# Altium project allaki_mezzanine.PrjPCB (part 1 of 2)
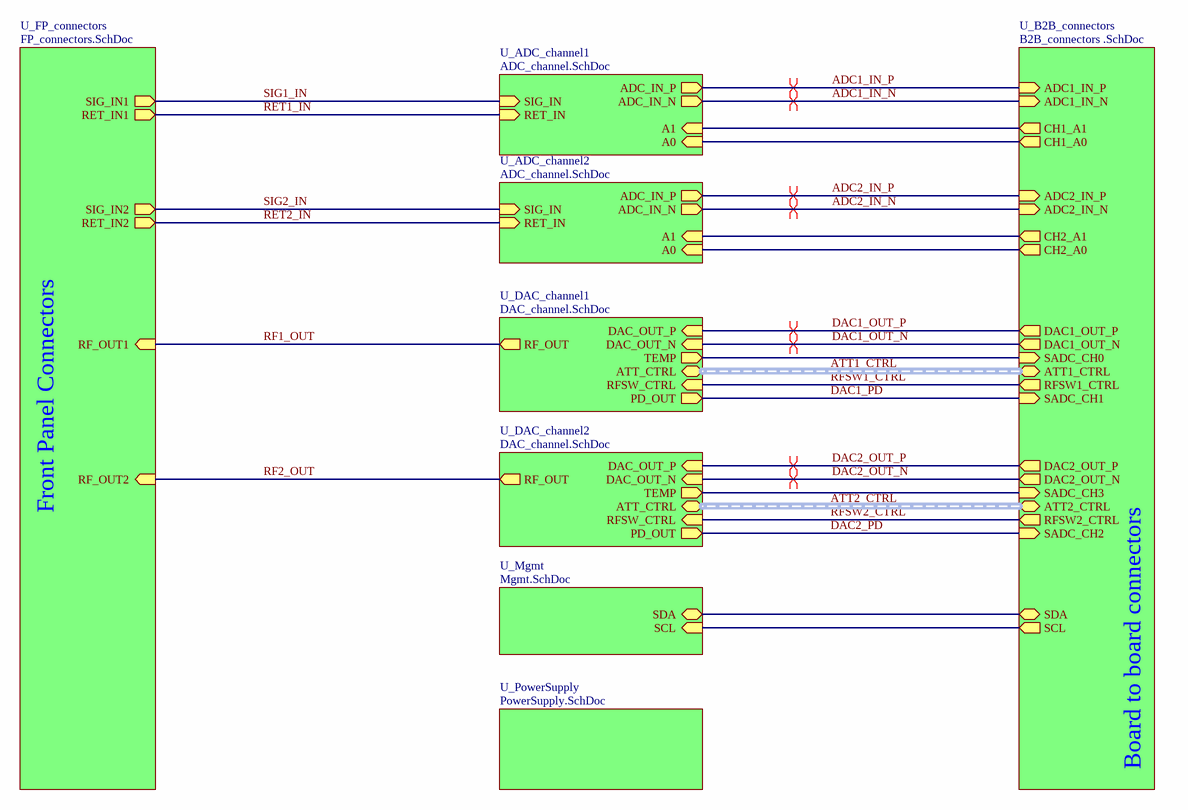
[diagram p0: allaki_mezz_top.SchDoc]
7 sheets, 312 parts. Net scope: hierarchical (ports join the sheet entries above them; power ports are global).
Board file: allaki_mezzanine.PcbDoc
Sheets:
  allaki_mezz_top.SchDoc
    U_ADC_channel1 = ADC_channel.SchDoc
    U_DAC_channel1 = DAC_channel.SchDoc
    U_ADC_channel2 = ADC_channel.SchDoc
    U_DAC_channel2 = DAC_channel.SchDoc
    U_FP_connectors = FP_connectors.SchDoc
    U_B2B_connectors = B2B_connectors .SchDoc
    U_PowerSupply = PowerSupply.SchDoc
    U_Mgmt = Mgmt.SchDoc

## Sheet allaki_mezz_top.SchDoc: =ProjectName
size 420 x 297 mm; Author: SBH; CompanyName: WUT; DrawnBy: SBH; Organization: ISE-WUT; Address1: Warsaw Univeristy of Technology; Address2: Nowowiejska 15/19; Revision: -; SheetNumber: 1; EDA_Number: ARTIQ; Projet: ADC/DAC MEZZANINE; ModifiedBy: -; CreateDate: XX/XX/XXXX; CheckedDate: -; Title2: allaki_mezz_top.SchDoc; DivGrp: ISE; Designer: SBH; ModifiedDate: -; ProjectName: ADC/DAC MEZZANINE

### Sub-sheets
U_ADC_channel1 = ADC_channel.SchDoc: ADC_IN_N (out), ADC_IN_P (out), SIG_IN (in), RET_IN (in), A1 (in), A0 (in)
U_ADC_channel2 = ADC_channel.SchDoc: ADC_IN_P (out), ADC_IN_N (out), SIG_IN (in), RET_IN (in), A1 (in), A0 (in)
U_B2B_connectors = B2B_connectors .SchDoc: ADC1_IN_N (in), ADC1_IN_P (in), DAC1_OUT_N (out), DAC1_OUT_P (out), DAC2_OUT_N (out), DAC2_OUT_P (out), ADC2_IN_N (in), ADC2_IN_P (in), ATT1_CTRL (harness ATT_CTRL), ATT2_CTRL (harness ATT_CTRL), RFSW1_CTRL (out), RFSW2_CTRL (out), SDA (bidir), SCL (out), SADC_CH2 (in), SADC_CH1 (in), CH1_A0 (out), CH2_A1 (out), CH1_A1 (out), CH2_A0 (out), SADC_CH0 (in), SADC_CH3 (in)
U_DAC_channel1 = DAC_channel.SchDoc: DAC_OUT_P (in), DAC_OUT_N (in), RF_OUT (out), ATT_CTRL (harness ATT_CTRL), RFSW_CTRL (in), PD_OUT (out), TEMP (out)
U_DAC_channel2 = DAC_channel.SchDoc: DAC_OUT_P (in), DAC_OUT_N (in), RF_OUT (out), RFSW_CTRL (in), ATT_CTRL (harness ATT_CTRL), PD_OUT (out), TEMP (out)
U_FP_connectors = FP_connectors.SchDoc: RF_OUT1 (in), RF_OUT2 (in), SIG_IN1 (out), SIG_IN2 (out), RET_IN1 (out), RET_IN2 (out)
U_Mgmt = Mgmt.SchDoc: SDA (bidir), SCL (in)
U_PowerSupply = PowerSupply.SchDoc: no entries

### Nets
ADC1_IN_N: sheet U_ADC_channel1/ADC_IN_N, sheet U_B2B_connectors/ADC1_IN_N
ADC1_IN_P: sheet U_ADC_channel1/ADC_IN_P, sheet U_B2B_connectors/ADC1_IN_P
ADC2_IN_N: sheet U_ADC_channel2/ADC_IN_N, sheet U_B2B_connectors/ADC2_IN_N
ADC2_IN_P: sheet U_ADC_channel2/ADC_IN_P, sheet U_B2B_connectors/ADC2_IN_P
ADC_CH0: sheet U_DAC_channel1/TEMP, sheet U_B2B_connectors/SADC_CH0
ADC_CH1: sheet U_DAC_channel2/TEMP, sheet U_B2B_connectors/SADC_CH3
DAC1_OUT_N: sheet U_DAC_channel1/DAC_OUT_N, sheet U_B2B_connectors/DAC1_OUT_N
DAC1_OUT_P: sheet U_DAC_channel1/DAC_OUT_P, sheet U_B2B_connectors/DAC1_OUT_P
DAC1_PD: sheet U_DAC_channel1/PD_OUT, sheet U_B2B_connectors/SADC_CH1  [project net ADC_CH3]
DAC2_OUT_N: sheet U_DAC_channel2/DAC_OUT_N, sheet U_B2B_connectors/DAC2_OUT_N
DAC2_OUT_P: sheet U_DAC_channel2/DAC_OUT_P, sheet U_B2B_connectors/DAC2_OUT_P
DAC2_PD: sheet U_DAC_channel2/PD_OUT, sheet U_B2B_connectors/SADC_CH2  [project net ADC_CH2]
MEZZ_IO4: sheet U_ADC_channel1/A1, sheet U_B2B_connectors/CH1_A1
MEZZ_IO5: sheet U_ADC_channel1/A0, sheet U_B2B_connectors/CH1_A0
MEZZ_IO8: sheet U_ADC_channel2/A1, sheet U_B2B_connectors/CH2_A1
MEZZ_IO10: sheet U_ADC_channel2/A0, sheet U_B2B_connectors/CH2_A0
RET1_IN: sheet U_ADC_channel1/RET_IN, sheet U_FP_connectors/RET_IN1
RET2_IN: sheet U_ADC_channel2/RET_IN, sheet U_FP_connectors/RET_IN2
RF1_OUT: sheet U_DAC_channel1/RF_OUT, sheet U_FP_connectors/RF_OUT1
RF2_OUT: sheet U_DAC_channel2/RF_OUT, sheet U_FP_connectors/RF_OUT2
RFSW1_CTRL: sheet U_DAC_channel1/RFSW_CTRL, sheet U_B2B_connectors/RFSW1_CTRL  [project net MEZZ_IO7]
RFSW2_CTRL: sheet U_DAC_channel2/RFSW_CTRL, sheet U_B2B_connectors/RFSW2_CTRL  [project net MEZZ_IO2]
SCL: sheet U_B2B_connectors/SCL, sheet U_Mgmt/SCL
SDA: sheet U_B2B_connectors/SDA, sheet U_Mgmt/SDA
SIG1_IN: sheet U_ADC_channel1/SIG_IN, sheet U_FP_connectors/SIG_IN1
SIG2_IN: sheet U_ADC_channel2/SIG_IN, sheet U_FP_connectors/SIG_IN2

### Buses and harness runs
harness ATT1_CTRL = sheet U_B2B_connectors/ATT1_CTRL = sheet U_DAC_channel1/ATT_CTRL
harness ATT2_CTRL = sheet U_B2B_connectors/ATT2_CTRL = sheet U_DAC_channel2/ATT_CTRL

### Layout directives
differential pair: ADC1_IN_N, ADC1_IN_P, ADC2_IN_N, ADC2_IN_P, DAC1_OUT_N, DAC1_OUT_P, DAC2_OUT_N, DAC2_OUT_P

### Notes on the sheet
- Front Panel Connectors
- Board to board connectors
- Project/Equipment
- Document
- Designer
- Drawn by
- Check.by
- File
- Last Mod.
- Print Date
- Sheet
- Size
- A3
- of
- Rev

## Sheet ADC_channel.SchDoc: =ProjectName
size 420 x 297 mm; Author: SBH; CompanyName: WUT; DrawnBy: SBH; Organization: ISE-WUT; Address1: Warsaw Univeristy of Technology; Address2: Nowowiejska 15/19; Revision: -; SheetNumber: -; SheetTotal: -; EDA_Number: ARTIQ; Projet: ADC/DAC MEZZANINE; ModifiedBy: -; CreateDate: XX/XX/XXXX; CheckedDate: -; Title2: ADC_channel.SchDoc; DivGrp: ISE; Designer: SBH; ModifiedDate: -; ProjectName: ADC/DAC MEZZANINE
Used 2 times, as channels U_ADC_channel1, U_ADC_channel2. Parts and nets are listed once, with the designators drawn on the sheet.
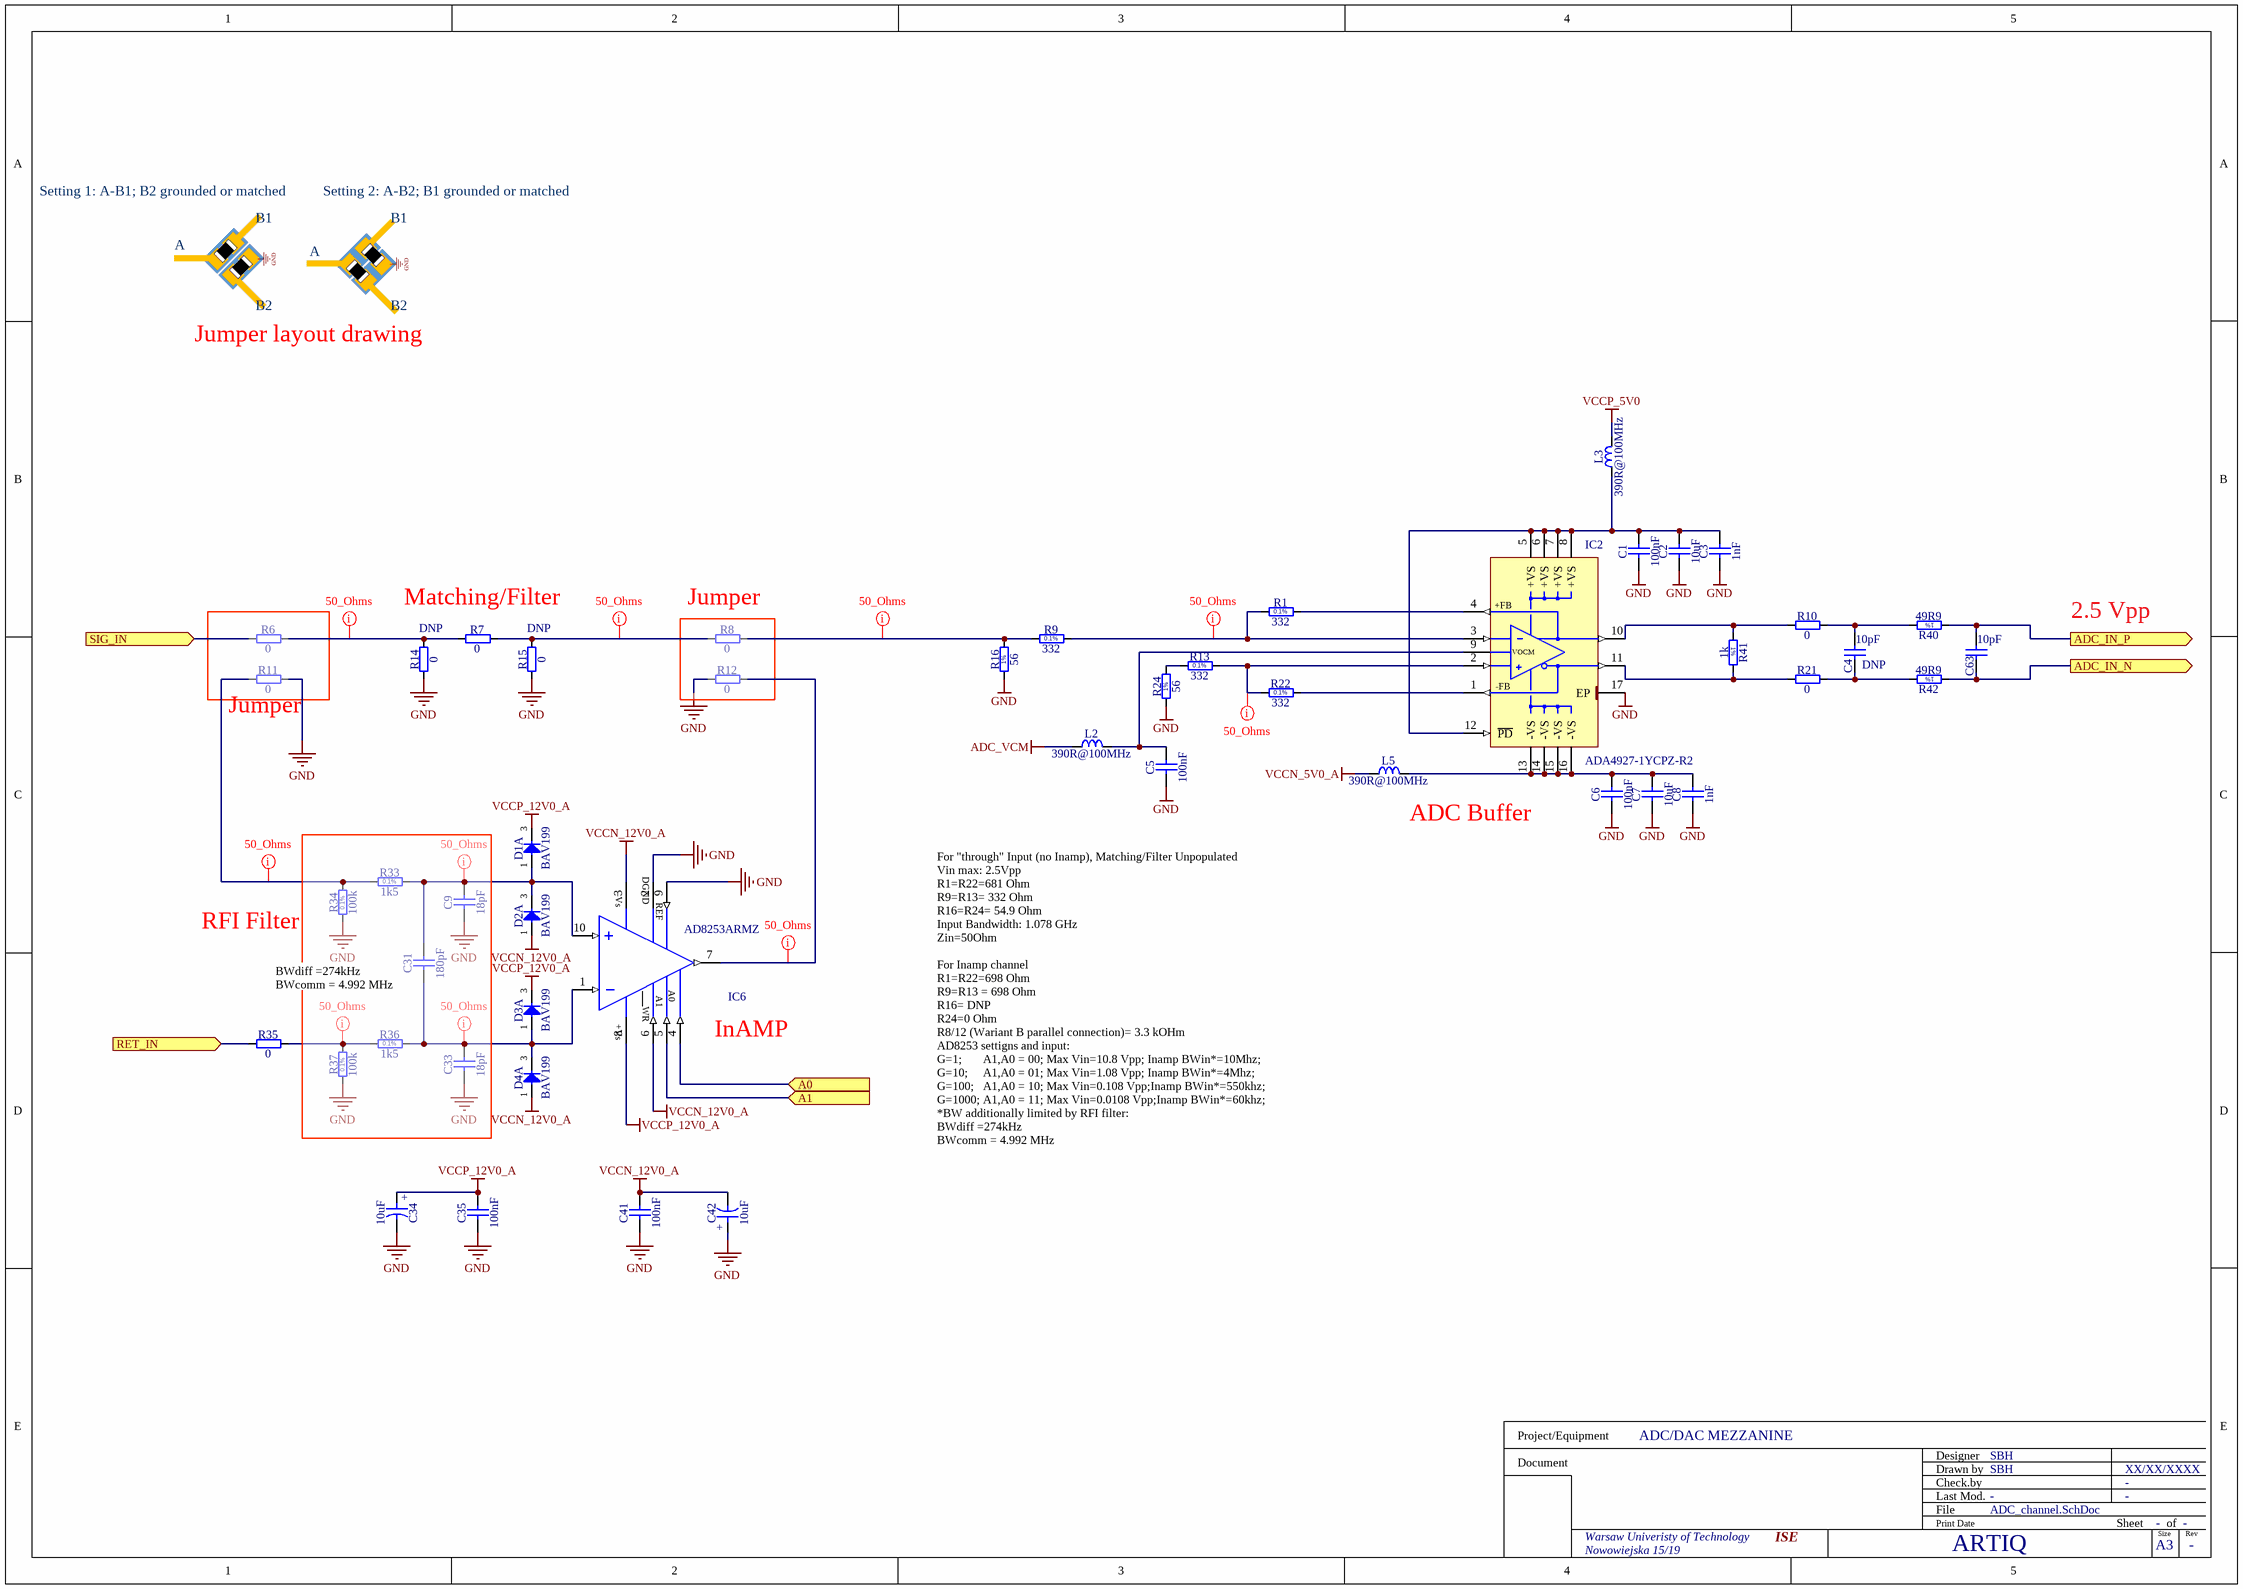
[diagram p1: ADC_channel.SchDoc]

### Parts
C1  100nF  [CAPC1005X55N]
C2  10uF  [CAPC1608X87N]
C3  1nF  [CAPC1005X55N]
C4  10pF  Mounted: DNP  [CAPC1608X87N]
C5  100nF  [CAPC1005X55N]
C6  100nF  [CAPC1005X55N]
C7  10uF  [CAPC1608X87N]
C8  1nF  [CAPC1005X55N]
C9  18pF  [CAPC1005X55N]
C31  180pF  [CAPC3216X140N]
C33  18pF  [CAPC1005X55N]
C34  10uF  [CAPMP3216X180N]
C35  100nF  [CAPC1005X55N]
C41  100nF  [CAPC1005X55N]
C42  10uF  [CAPMP3216X180N]
C63  10pF  [CAPC1608X87N]
D1  BAV199  [SOT95P240X110-3N]  (part A of 2)
D2  BAV199  [SOT95P240X110-3N]  (part A of 2)
D3  BAV199  [SOT95P240X110-3N]  (part A of 2)
D4  BAV199  [SOT95P240X110-3N]  (part A of 2)
IC2  ADA4927-1YCPZ-R2  [QFN50P300X300X100-17N-S145]
IC6  AD8253ARMZ  [SOP50P490X110-10N]
L2  390R@100MHz  [INDC1608X95N]
L3  390R@100MHz  [INDC1608X95N]
L5  390R@100MHz  [INDC1608X95N]
R1  332  [RESC1608X55N]
R6  0  [RESC1005X40N]
R7  0  [RESC1005X40N]
R8  0  [RESC1005X40N]
R9  332  [RESC1608X55N]
R10  0  [RESC1005X40N]
R11  0  [RESC1005X40N]
R12  0  [RESC1005X40N]
R13  332  [RESC1608X55N]
R14  0  Mounted: DNP  [RESC1005X40N]
R15  0  Mounted: DNP  [RESC1005X40N]
R16  56  [RESC1005X40N]
R21  0  [RESC1005X40N]
R22  332  [RESC1608X55N]
R24  56  [RESC1005X40N]
R33  1k5  [RESC1608X55N]
R34  100k  [RESC1005X35N]
R35  0  [RESC1005X40N]
R36  1k5  [RESC1608X55N]
R37  100k  [RESC1005X35N]
R40  49R9  [RESC1005X40N]
R41  1k  [RESC1005X40N]
R42  49R9  [RESC1005X40N]

### Blocks framed on the sheet
Jumper: R8 R12

### Ports
A0 (in), A1 (in), ADC_IN_N (out), ADC_IN_P (out), RET_IN (in), SIG_IN (in)

### Nets
ADC_VCM: L2.1
GND: C1.1 C2.1 C3.1 C5.1 C6.1 C7.1 C8.1 C9.1 C33.1 C34.2 C35.1 C41.1 C42.1 IC2.17(EP) IC6.2(DGND) IC6.9(REF) R11.2 R12.2 R14.1 R15.1 R16.1 R24.1 R34.1 R37.1
VCCN_5V0_A: L5.1
VCCN_12V0_A: C41.2 C42.2 D2.1(A) D4.1(A) IC6.3(-VS) IC6.6(~{WR})
VCCP_5V0: L3.2
VCCP_12V0_A: C34.1 C35.2 D1.3(COMAC) D3.3(COMAC) IC6.8(+VS)
A0: IC6.4(A0) ; port A0
A1: IC6.5(A1) ; port A1
ADC_IN_N: C63.1 R42.1 ; port ADC_IN_N
ADC_IN_P: C63.2 R40.1 ; port ADC_IN_P
RET_IN: R35.1 ; port RET_IN
SIG_IN: R6.1 ; port SIG_IN
NetC1_2: C1.2 C2.2 C3.2 IC2.5(+VS) IC2.6(+VS) IC2.7(+VS) IC2.8(+VS) IC2.12(~{PD}) L3.1
NetC4_1: C4.1 R21.2 R42.2
NetC4_2: C4.2 R10.2 R40.2
NetC5_2: C5.2 IC2.9(VOCM) L2.2
NetC6_2: C6.2 C7.2 C8.2 IC2.13(-VS) IC2.14(-VS) IC2.15(-VS) IC2.16(-VS) L5.2
NetC9_2: C9.2 C31.2 D1.1(A) D2.3(COMAC) IC6.10(+IN) R33.2
NetC31_1: C31.1 C33.2 D3.1(A) D4.3(COMAC) IC6.1(-IN) R36.2
NetIC2_1: IC2.1(-FB) R22.2
NetIC2_2: IC2.2(+IN) R13.2 R22.1
NetIC2_3: IC2.3(-IN) R1.1 R9.2
NetIC2_4: IC2.4(+FB) R1.2
NetIC2_10: IC2.10(+OUT) R10.1 R41.1
NetIC2_11: IC2.11(-OUT) R21.1 R41.2
NetIC6_7: IC6.7(OUT) R12.1
NetR6_2: R6.2 R7.1 R14.2
NetR7_2: R7.2 R8.2 R15.2
NetR8_1: R8.1 R9.1 R16.2
NetR11_1: R11.1 R33.1 R34.2
NetR13_1: R13.1 R24.2
NetR35_2: R35.2 R36.1 R37.2

### Channels
U_ADC_channel1: designators end in A; ports A0=MEZZ_IO5 A1=MEZZ_IO4 ADC_IN_N=ADC1_IN_N ADC_IN_P=ADC1_IN_P RET_IN=RET1_IN SIG_IN=SIG1_IN
U_ADC_channel2: designators end in B; ports A0=MEZZ_IO10 A1=MEZZ_IO8 ADC_IN_N=ADC2_IN_N ADC_IN_P=ADC2_IN_P RET_IN=RET2_IN SIG_IN=SIG2_IN

### Layout directives
net class 50_Ohms: NetC9A_2, NetC31A_1, NetIC2A_2, NetIC2A_3, NetIC6A_7, NetR6A_2, NetR7A_2, NetR8A_1, NetR11A_1, NetR35A_2

### Notes on the sheet
- Setting 1: A-B1; B2 grounded or matched
- A
- B1
- Setting 2: A-B2; B1 grounded or matched
- B2
- Jumper layout drawing
- Matching/Filter
- 2.5 Vpp
- (near R11) Jumper
- (near L5) ADC Buffer
- (near R34) RFI Filter
- (near C31) BWdiff =274kHz
  BWcomm = 4.992 MHz
- (near IC6) InAMP
- For "through" Input (no Inamp), Matching/Filter Unpopulated
  Vin max: 2.5Vpp
  R1=R22=681 Ohm
  R9=R13= 332 Ohm
  R16=R24= 54.9 Ohm
  Input Bandwidth: 1.078 GHz
  Zin=50Ohm
  For Inamp channel
  R1=R22=698 Ohm
  R9=R13 = 698 Ohm
  R16= DNP
  R24=0 Ohm
  R8/12 (Wariant B parallel connection)= 3.3 kOHm
  AD8253 settigns and input:
  G=1;       A1,A0 = 00; Max Vin=10.8 Vpp; Inamp BWin*=10Mhz;
  G=10;     A1,A0 = 01; Max Vin=1.08 Vpp; Inamp BWin*=4Mhz;
  G=100;   A1,A0 = 10; Max Vin=0.108 Vpp;Inamp BWin*=550khz;
  G=1000; A1,A0 = 11; Max Vin=0.0108 Vpp;Inamp BWin*=60khz;
  *BW additionally limited by RFI filter:
  BWdiff =274kHz
  BWcomm = 4.992 MHz
- Project/Equipment
- Document
- Designer
- Drawn by
- Check.by
- File
- Last Mod.
- Print Date
- Sheet
- Size
- A3
- of
- Rev
- (in symbol AD8253ARMZ) -Vs; WR; +Vs
- (in symbol CTE3216-18_10UF_16V_20%_AVX_TCJ) +
- (in symbol R0402_1K_1%_0.0625W_100PPM) 1%
- (in symbol R0402_49R9_1%_0.0625W_100PPM) 1%
- (in symbol R0402_56R_1%_0.0625W_100PPM) 1%
- (in symbol R0402_100K_0.1%_0.063W_25PPM) 0.1%
- (in symbol R0603_1K5_0.1%_0.063W_10PPM) 0.1%
- (in symbol R0603_332R_0.1%_0.063W_10PPM) 0.1%

### Library data of the parts
C1 C5 C6 = CC0402_100NF_16V_10%_X5R: Non-polarised capacitor; Part Description: SMD Multilayer Chip Ceramic Capacitor; Manufacturer: GENERIC; Manufacturer1 Part Number: GRM155R61C104KA88D; Voltage: 16V; TC: X5R; Tolerance: ±10%; Part Number: CC0402_100NF_16V_10%_X5R; Component Kind: Standard; Component Type: Standard; Pin Count: 2; Value: 100nF; Status: None; Manufacturer Part Number: CC0402_100NF_16V_10%_X5R; Case: 0402; Mounted: Yes; Socket: No; SMD: Yes; Sense: No; Manufacturer1 Example: MURATA; Manufacturer1 ComponentHeight: 0.55mm; HelpURL: \\cern.ch\dfs\Applications\Altium\Datasheets\CC0402_X5R_MURATA_GRM.pdf; Author: CERN DEM JLC; CreateDate: 10.12.2013; LatestRevisionDate: 10.12.2013
C2 C7 = CC0603_10UF_6.3V_20%_X5R: Non-polarised capacitor; Part Description: SMD Multilayer Chip Ceramic Capacitor; Manufacturer: GENERIC; Manufacturer1 Part Number: C0603C106M9PAC; Voltage: 6.3V; TC: X5R; Tolerance: ±20%; Part Number: CC0603_10UF_6.3V_20%_X5R; Component Kind: Standard; Component Type: Standard; Pin Count: 2; Value: 10uF; Status: Preferred; Manufacturer Part Number: CC0603_10uF_6.3V_20%_X5R; Case: 0603; Mounted: Yes; Socket: No; SMD: Yes; Sense: No; Manufacturer1 Example: KEMET; Manufacturer1 ComponentHeight: 0.95mm; HelpURL: \\cern.ch\dfs\Applications\Altium\Datasheets\CC0603_X5R_KEMET.pdf; Author: CERN DEM JLC; CreateDate: 03.12.2007; LatestRevisionDate: 03.12.2007
C3 C8 = CC0402_1NF_50V_10%_X7R: Non-polarised capacitor; Part Description: SMD Multilayer Chip Ceramic Capacitor; Manufacturer: GENERIC; Manufacturer1 Part Number: 223858715623; Voltage: 50V; TC: X7R; Tolerance: ±10%; Part Number: CC0402_1NF_50V_10%_X7R; Component Kind: Standard; Component Type: Standard; Pin Count: 2; Value: 1nF; Status: Not Recommended; Manufacturer Part Number: CC0402_1NF_50V_10%_X7R; Case: 0402; Mounted: Yes; Socket: No; SMD: Yes; Sense: No; Manufacturer1 Example: PHYCOMP; Manufacturer1 ComponentHeight: 0.55mm; HelpURL: \\cern.ch\dfs\Applications\Altium\Datasheets\CC0402_X7R_PHYCOMP.pdf; Author: CERN DEM JLC; CreateDate: 03.12.2007; LatestRevisionDate: 03.12.2007
C4 C63 = CC0603_10PF_50V_5%_NP0: Non-polarised capacitor; Part Description: SMD Multilayer Chip Ceramic Capacitor; Manufacturer: GENERIC; Manufacturer1 Part Number: 223886715109; Voltage: 50V; TC: C0G/NP0; Tolerance: ±5%; Part Number: CC0603_10PF_50V_5%_NP0; Component Kind: Standard; Component Type: Standard; Pin Count: 2; Value: 10pF; Status: Preferred; Manufacturer Part Number: CC0603_10PF_50V_5%_NP0; Case: 0603; Socket: No; SMD: Yes; Sense: No; Manufacturer1 Example: PHYCOMP; Manufacturer1 ComponentHeight: 0.87mm; HelpURL: \\cern.ch\dfs\Applications\Altium\Datasheets\CC0603_NP0_PHYCOMP.pdf; Author: CERN DEM JLC; CreateDate: 03.12.2007; LatestRevisionDate: 03.12.2007
  C63: Mounted: Yes
C9 C33 = CC0402_18PF_50V_5%_C0G: Non-polarised capacitor; Part Description: SMD Multilayer Chip Ceramic Capacitor; Manufacturer: GENERIC; Manufacturer1 Part Number: C0402C180J5GACTU; Voltage: 50V; TC: C0G/NP0; Tolerance: ±5%; Part Number: CC0402_18PF_50V_5%_C0G; Component Kind: Standard; Component Type: Standard; Pin Count: 2; Value: 18pF; Status: Preferred; Manufacturer Part Number: CC0402_18PF_50V_5%_C0G; Case: 0402; Mounted: Yes; Socket: No; SMD: Yes; Sense: No; Manufacturer1 Example: KEMET; Manufacturer1 ComponentHeight: 0.55mm; HelpURL: \\cern.ch\dfs\Applications\Altium\Datasheets\CC0805_C0G_KEMET_(Commercial Grade).pdf; Author: CERN DEM JLC; CreateDate: 2016-10-04; LatestRevisionDate: 2016-10-04
C31 = CC1206_180PF_50V_5%_NP0: Non-polarised capacitor; Part Description: SMD Multilayer Chip Ceramic Capacitor; Manufacturer: GENERIC; Manufacturer1 Part Number: VJ1206A181JXAAT; Voltage: 50V; TC: C0G/NP0; Tolerance: ±5%; Part Number: CC1206_180PF_50V_5%_NP0; Component Kind: Standard; Component Type: Standard; Pin Count: 2; Value: 180pF; Status: Preferred; Manufacturer Part Number: CC1206_180PF_50V_5%_NP0; Case: 1206; Mounted: Yes; Socket: No; SMD: Yes; Sense: No; Manufacturer1 Example: VISHAY VITRAMON; Manufacturer1 ComponentHeight: 1.7mm; HelpURL: \\cern.ch\dfs\Applications\Altium\Datasheets\CC1206_NP0_VISHAY_VJ.pdf; Author: CERN DEM JLC; CreateDate: 2007-12-03; LatestRevisionDate: 2007-12-03
C34 C42 = CTE3216-18_10UF_16V_20%_AVX_TCJ: Polarised capacitor; Part Description: ESR 0R200 Tantalum Solid Electrolytic Chip Capacitor with Conductive Polymer Electrode; Manufacturer: AVX; Manufacturer Part Number: TCJA106M016R0200; Voltage: 16V; Tolerance: ±20%; Part Number: CTE3216-18_10UF_16V_20%_AVX_TCJ; Component Kind: Standard; Component Type: Standard; Pin Count: 2; Value: 10uF; Status: Preferred; Case: A; Mounted: Yes; Socket: No; SMD: Yes; Sense: No; HelpURL: \\cern.ch\dfs\Applications\Altium\Datasheets\CTE_AVX_TCJ.pdf; Author: CERN DEM JLC; CreateDate: 2012-03-29; LatestRevisionDate: 2012-03-29; ComponentHeight: 1.8mm
C35 C41 = CC0402_100NF_16V_10%_X7R: Non-polarised capacitor; Part Description: SMD Multilayer Chip Ceramic Capacitor; Manufacturer: GENERIC; Manufacturer1 Part Number: GRM155R71C104KA88D; Voltage: 16V; TC: X7R; Tolerance: ±10%; Part Number: CC0402_100NF_16V_10%_X7R; Component Kind: Standard; Component Type: Standard; Pin Count: 2; Value: 100nF; Status: Not Recommended; Manufacturer Part Number: CC0402_100NF_16V_10%_X7R; Case: 0402; Mounted: Yes; Socket: No; SMD: Yes; Sense: No; Manufacturer1 Example: MURATA; Manufacturer1 ComponentHeight: 0.55mm; HelpURL: \\cern.ch\dfs\Applications\Altium\Datasheets\CC0402_X7R_MURATA_GRM.pdf; Author: CERN DEM JLC; CreateDate: 2013-12-05; LatestRevisionDate: 2007-12-03
D1-D4 = BAV199: Serial Diode; Part Description: Low-Leakage Double Diode; Manufacturer: NXP SEMICONDUCTORS; Voltage: 75V; Power: 250mW; PressFit: No; Bonding: No; Part Number: BAV199; Component Kind: Standard; Component Type: Standard; Device: BAV199; PackageDescription: SOT23 3-Leads, Pitch 0.95mm - Body 1.4x3mm, IPC Medium Density; Manufacturer Part Number: BAV199; Pin Count: 3; Case: SOT23-3; Mounted: Yes; Socket: No; SMD: Yes; Sense: No; ComponentHeight: 1.1mm; HelpURL: \\cern.ch\dfs\Applications\Altium\Datasheets\BAV199.pdf; Author: CERN DEM JMW; CreateDate: 2008-11-21; LatestRevisionDate: 2008-11-21
IC2 = ADA4927-1YCPZ-R2: Ultralow Distortion Current Feedback Differential ADC Driver; Manufacturer: ANALOG DEVICES; PressFit: No; Bonding: No; Part Number: ADA4927-1YCPZ-R2; Component Kind: Standard; Component Type: Standard; Device: ADA4927-1YCPZ-R2; PackageDescription: QFN,0.50mm pitch,square; 4 pin X 4 pin, 3mm X 3mm X 1.00mm H body (w/thermal tab 1.45 X 1.45mm),  IPC Medium Density; Part Description: Ultralow Distortion Current Feedback Differential ADC Driver; Manufacturer Part Number: ADA4927-1YCPZ-R2; Pin Count: 17; Case: QFN16; Mounted: Yes; Socket: No; SMD: Yes; Sense: No; ComponentHeight: 1mm; Author: CERN DEM JLC; HelpURL: \\cern.ch\dfs\Applications\Altium\Datasheets\ADA4927-1YCPZ-R2.pdf; CreateDate: 19.04.2010; LatestRevisionDate: 19.04.2010
IC6 = AD8253ARMZ: 10MHz, 20V/us, G= 1, 10, 100, 1000 iCMOS Programmable Gain Instrumentation Amplifier; Manufacturer: ANALOG DEVICES; PressFit: No; Bonding: No; Part Number: AD8253ARMZ; Component Kind: Standard; Component Type: Standard; Device: AD8253ARMZ; PackageDescription: MSOP, 10-Leads, Body 3.1x3.1mm (max), Pitch 0.50mm, IPC Medium Density; Part Description: 10MHz, 20V/us, G= 1, 10, 100, 1000 iCMOS Programmable Gain Instrumentation Amplifier; Manufacturer Part Number: AD8253ARMZ; Pin Count: 8; Case: MSOP10; Mounted: Yes; Socket: No; SMD: Yes; Sense: No; ComponentHeight: 1.1mm; Author: CERN DEM JLC; HelpURL: \\cern.ch\dfs\Applications\Altium\Datasheets\AD8253ARMZ.pdf; CreateDate: 2013-10-02; LatestRevisionDate: 2013-10-02
L2 L3 L5 = IND0603_TDK_MPZ1608R391A: Inductor; Part Description: SMT Chip Bead for Power Line; Manufacturer: TDK; Power: 1.2A; Resistance: 0.12R; Tolerance: ±25%; Part Number: IND0603_TDK_MPZ1608R391A; Component Kind: Standard; Component Type: Standard; Pin Count: 2; Value: 390R@100MHz; Status: None; Manufacturer Part Number: MPZ1608R391A; Case: 0603; Mounted: Yes; Socket: No; SMD: Yes; Sense: No; ComponentHeight: 0.95mm; HelpURL: \\cern.ch\dfs\Applications\Altium\Datasheets\IND0603_TDK_MPZ1608.pdf; Author: CERN DEM JLC; CreateDate: 2009-12-02; LatestRevisionDate: 2009-12-02
R1 R9 R13 R22 = R0603_332R_0.1%_0.063W_10PPM: Resistor - 0.1%; Part Description: Thin Film Chip Resistor; Manufacturer: GENERIC; Manufacturer1 Part Number: RN73C1J332RBTDF; Power: 0.063W; TC: ±10ppm; Part Number: R0603_332R_0.1%_0.063W_10PPM; Component Kind: Standard; Component Type: Standard; Pin Count: 2; Value: 332; Status: Not recommended; Tolerance: ±0.1%; Manufacturer Part Number: R0603_332R_0.1%_0.063W_10PPM; Case: 0603; Mounted: Yes; Sense: No; Socket: No; SMD: Yes; Manufacturer1 Example: TYCO HOLSWORTHY; Manufacturer1 ComponentHeight: 0.5mm; HelpURL: \\cern.ch\dfs\Applications\Altium\Datasheets\R0603_Tyco_RN73.pdf; Author: CERN DEM JLC; CreateDate: 03.12.2007; LatestRevisionDate: 13.03.2008
R6-R8 R10-R12 R14 R15 R21 R35 = R0402_0R_JUMPER: Resistor; Part Description: 1A (0.05R Max DC Resistance) Zero Ohm Jumper; Manufacturer: GENERIC; Manufacturer1 Part Number: 232270591001L; Part Number: R0402_0R_JUMPER; Component Kind: Standard; Component Type: Standard; Pin Count: 2; Value: 0; Status: Not recommended; Manufacturer Part Number: R0402_0R_JUMPER; Case: 0402; Sense: No; Socket: No; SMD: Yes; Manufacturer1 Example: YAGEO PHYCOMP; Manufacturer1 ComponentHeight: 0.4mm; HelpURL: \\cern.ch\dfs\Applications\Altium\Datasheets\R0402_Phycomp_RC0402.pdf; Author: CERN DEM JLC; CreateDate: 2007-12-03; LatestRevisionDate: 2012-10-17
  R6-R8 R10-R12 R21 R35: Mounted: Yes
R16 R24 = R0402_56R_1%_0.0625W_100PPM: Resistor - 1%; Part Description: General Purpose Thick Film Chip Resistor; Manufacturer: GENERIC; Manufacturer1 Part Number: 232270675609L; TC: ±100ppm/°C; Part Number: R0402_56R_1%_0.0625W_100PPM; Component Kind: Standard; Component Type: Standard; Pin Count: 2; Value: 56; Status: Not recommended; Power: 0.0625W; Tolerance: ±1%; Manufacturer Part Number: R0402_56R_1%_0.0625W_100PPM; Case: 0402; Mounted: Yes; Sense: No; Socket: No; SMD: Yes; Manufacturer1 Example: YAGEO PHYCOMP; Manufacturer1 ComponentHeight: 0.4mm; HelpURL: \\cern.ch\dfs\Applications\Altium\Datasheets\R0402_Phycomp_RC0402.pdf; Author: CERN DEM JLC; CreateDate: 03.12.2007; LatestRevisionDate: 17.10.2012
R33 R36 = R0603_1K5_0.1%_0.063W_10PPM: Resistor - 0.1%; Part Description: Thin Film Chip Resistor; Manufacturer: GENERIC; Manufacturer1 Part Number: RN73C1J1K5BTDF; Power: 0.063W; TC: ±10ppm; Part Number: R0603_1K5_0.1%_0.063W_10PPM; Component Kind: Standard; Component Type: Standard; Pin Count: 2; Value: 1k5; Status: Not recommended; Tolerance: ±0.1%; Manufacturer Part Number: R0603_1K5_0.1%_0.063W_10PPM; Case: 0603; Mounted: Yes; Sense: No; Socket: No; SMD: Yes; Manufacturer1 Example: TYCO HOLSWORTHY; Manufacturer1 ComponentHeight: 0.5mm; HelpURL: \\cern.ch\dfs\Applications\Altium\Datasheets\R0603_Tyco_RN73.pdf; Author: CERN DEM JLC; CreateDate: 2007-12-03; LatestRevisionDate: 2008-03-13
R34 R37 = R0402_100K_0.1%_0.063W_25PPM: Resistor - 0.1%; Part Description: Thin Film Precision Resistor; Manufacturer: GENERIC; Manufacturer1 Part Number: CPF0402B100KE1; Power: 0.063W; TC: ±25ppm/°C; Part Number: R0402_100K_0.1%_0.063W_25PPM; Component Kind: Standard; Component Type: Standard; Pin Count: 2; Value: 100k; Status: Not Recommended; Tolerance: ±0.1%; Manufacturer Part Number: R0402_100K_0.1%_0.063W_25PPM; Case: 0402; Mounted: Yes; Sense: No; Socket: No; SMD: Yes; Manufacturer1 Example: TE CONNECTIVITY; Manufacturer1 ComponentHeight: 0.35mm; HelpURL: \\cern.ch\dfs\Applications\Altium\Datasheets\R0402_TYCO_CPF.pdf; Author: CERN DEM JMW; CreateDate: 2015-09-22; LatestRevisionDate: 2015-09-22
R40 R42 = R0402_49R9_1%_0.0625W_100PPM: Resistor - 1%; Part Description: General Purpose Thick Film Chip Resistor; Manufacturer: GENERIC; Manufacturer1 Part Number: 232270674999L or RC0402FR-0749R9L; TC: ±100ppm/°C; Part Number: R0402_49R9_1%_0.0625W_100PPM; Component Kind: Standard; Component Type: Standard; Pin Count: 2; Value: 49R9; Status: Not recommended; Power: 0.0625W; Tolerance: ±1%; Manufacturer Part Number: R0402_49R9_1%_0.0625W_100PPM; Case: 0402; Mounted: Yes; Sense: No; Socket: No; SMD: Yes; Manufacturer1 Example: YAGEO PHYCOMP; Manufacturer1 ComponentHeight: 0.4mm; HelpURL: \\cern.ch\dfs\Applications\Altium\Datasheets\R0402_Phycomp_RC0402.pdf; Author: CERN DEM JLC; CreateDate: 24.10.2012; LatestRevisionDate: 24.10.2012
R41 = R0402_1K_1%_0.0625W_100PPM: Resistor - 1%; Part Description: General Purpose Thick Film Chip Resistor; Manufacturer: GENERIC; Manufacturer1 Part Number: 232270671002L; TC: ±100ppm/°C; Part Number: R0402_1K_1%_0.0625W_100PPM; Component Kind: Standard; Component Type: Standard; Pin Count: 2; Value: 1k; Status: Not recommended; Power: 0.0625W; Tolerance: ±1%; Manufacturer Part Number: R0402_1K_1%_0.0625W_100PPM; Case: 0402; Mounted: Yes; Sense: No; Socket: No; SMD: Yes; Manufacturer1 Example: YAGEO PHYCOMP; Manufacturer1 ComponentHeight: 0.4mm; HelpURL: \\cern.ch\dfs\Applications\Altium\Datasheets\R0402_Phycomp_RC0402.pdf; Author: CERN DEM JLC; CreateDate: 2007-12-03; LatestRevisionDate: 2012-10-17

## Sheet DAC_channel.SchDoc: =ProjectName
size 420 x 297 mm; Author: SBH; CompanyName: WUT; DrawnBy: SBH; Organization: ISE-WUT; Address1: Warsaw Univeristy of Technology; Address2: Nowowiejska 15/19; Revision: -; SheetNumber: -; SheetTotal: -; EDA_Number: ARTIQ; Projet: ADC/DAC MEZZANINE; ModifiedBy: -; CreateDate: XX/XX/XXXX; CheckedDate: -; Title2: DAC_channel.SchDoc; DivGrp: ISE; Designer: SBH; ModifiedDate: -; ProjectName: ADC/DAC MEZZANINE
Used 2 times, as channels U_DAC_channel1, U_DAC_channel2. Parts and nets are listed once, with the designators drawn on the sheet.
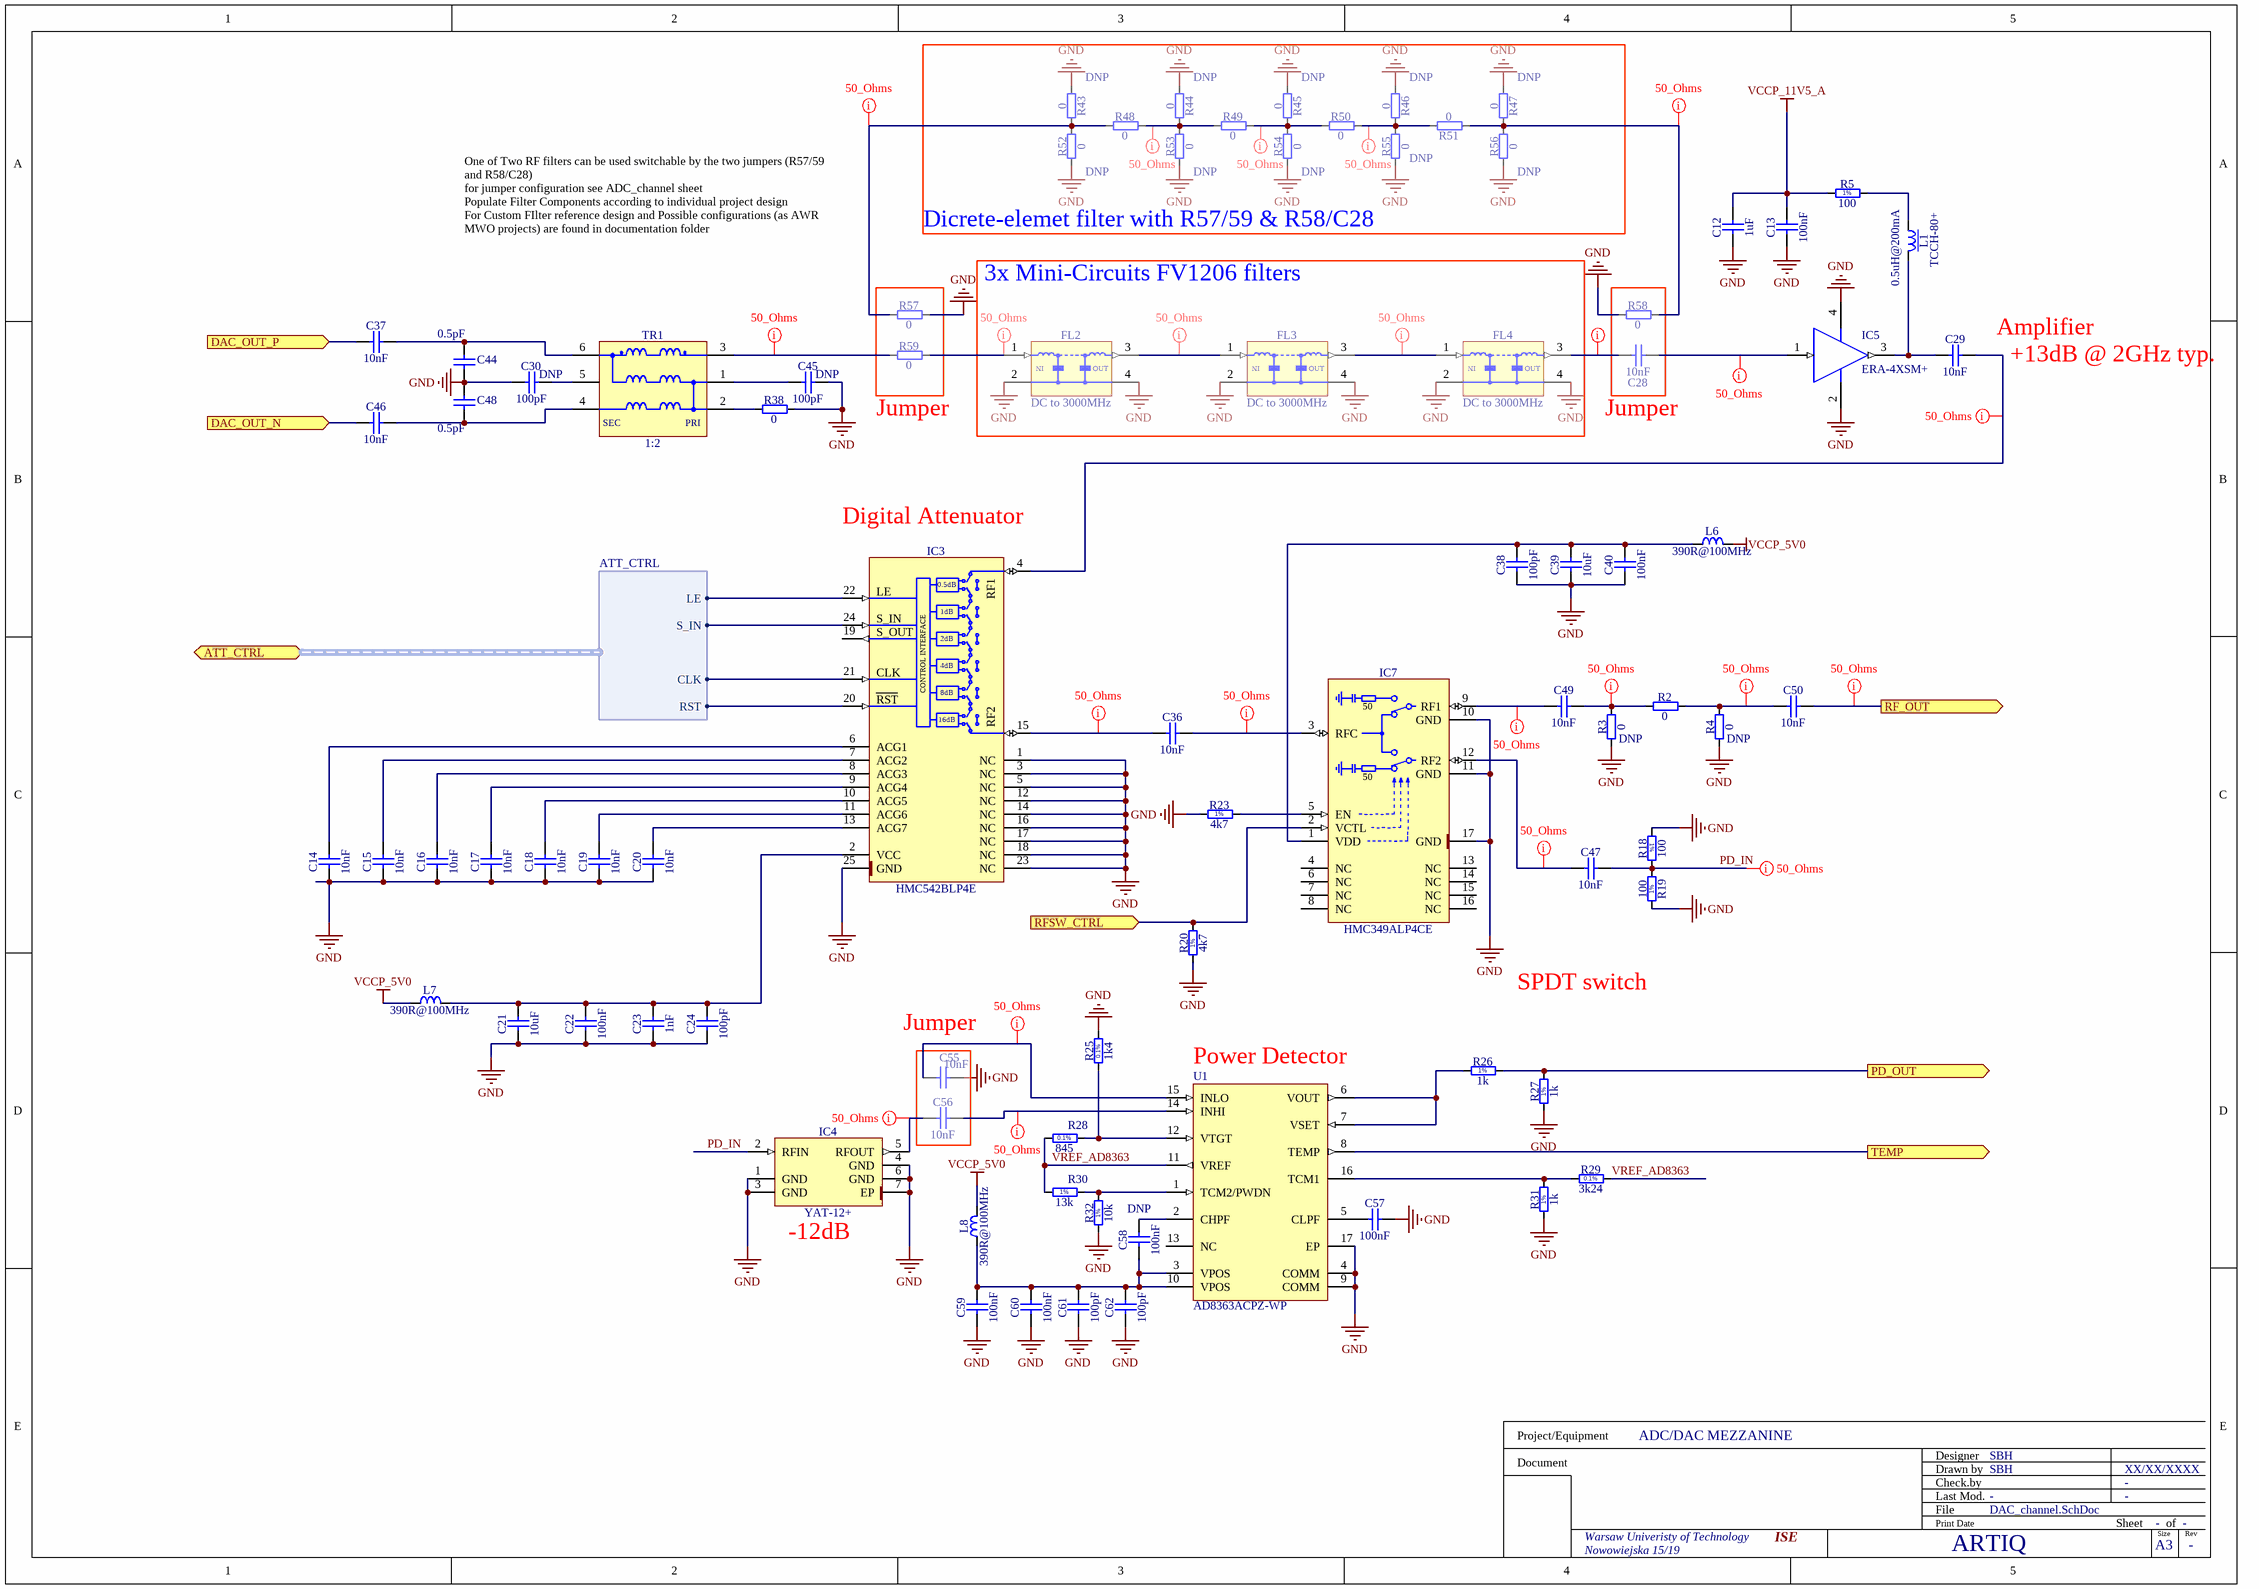
[diagram p2: DAC_channel.SchDoc]

### Parts
C12  1uF  [CAPC2012X140N]
C13  100nF  [CAPC1608X87N]
C14  10nF  [CAPC1005X55N]
C15  10nF  [CAPC1005X55N]
C16  10nF  [CAPC1005X55N]
C17  10nF  [CAPC1005X55N]
C18  10nF  [CAPC1005X55N]
C19  10nF  [CAPC1005X55N]
C20  10nF  [CAPC1005X55N]
C21  10uF  [CAPC1608X80N]
C22  100nF  [CAPC1005X55N]
C23  1nF  [CAPC1005X55N]
C24  100pF  [CAPC1005X55N]
C28  10nF  [CAPC1005X55N]
C29  10nF  [CAPC1005X55N]
C30  100pF  Mounted: DNP  [CAPC1005X55N]
C36  10nF  [CAPC1005X55N]
C37  10nF  [CAPC1005X55N]
C38  100pF  [CAPC1005X55N]
C39  10uF  [CAPC1608X80N]
C40  100nF  [CAPC1005X55N]
C44  0.5pF  [CAPC0402(1005)60_M]
C45  100pF  Mounted: DNP  [CAPC1005X55N]
C46  10nF  [CAPC1005X55N]
C47  10nF  [CAPC1005X55N]
C48  0.5pF  [CAPC0402(1005)60_M]
C49  10nF  [CAPC1005X55N]
C50  10nF  [CAPC1005X55N]
C55  10nF  [CAPC1005X55N]
C56  10nF  [CAPC1005X55N]
C57  100nF  [CAPC1005X55N]
C58  100nF  Mounted: DNP  [CAPC1005X55N]
C59  100nF  [CAPC1005X55N]
C60  100nF  [CAPC1005X55N]
C61  100pF  [CAPC1005X55N]
C62  100pF  [CAPC1005X55N]
FL2  DC to 3000MHz  [FIL_MINI-CIRCUITS_FV1206]
FL3  DC to 3000MHz  [FIL_MINI-CIRCUITS_FV1206]
FL4  DC to 3000MHz  [FIL_MINI-CIRCUITS_FV1206]
IC3  HMC542BLP4E  [QFN50P400X400X100-25N-S295]
IC4  YAT-12+  [MINI-CIRCUITS_MC1630]
IC5  ERA-4XSM+  [MINI-CIRCUITS_WW107]
IC7  HMC349ALP4CE  [QFN65P400X400X100-17N-S255]
L1  0.5uH@200mA  Manufacturer Part Number: TCCH-80+  [IND_MINI-CIRCUITS_GU1604]
L6  390R@100MHz  [INDC1608X95N]
L7  390R@100MHz  [INDC1608X95N]
L8  390R@100MHz  [INDC1608X95N]
R2  0  [RESC1005X40N]
R3  0  Mounted: DNP  [RESC1005X40N]
R4  0  Mounted: DNP  [RESC1005X40N]
R5  100  [RESC3216X65N]
R18  100  [RESC0603X28N]
R19  100  [RESC0603X28N]
R20  4k7  [RESC1005X40N]
R23  4k7  [RESC1005X40N]
R25  1k4  [RESC1608X55N]
R26  1k  [RESC1005X40N]
R27  1k  [RESC1005X40N]
R28  845  [RESC1608X55N]
R29  3k24  [RESC1608X55N]
R30  13k  [RESC1005X40N]
R31  1k  [RESC1005X40N]
R32  10k  [RESC1005X40N]
R38  0  [RESC1005X40N]
R43  0  Mounted: DNP  [RESC1005X40N]
R44  0  Mounted: DNP  [RESC1005X40N]
R45  0  Mounted: DNP  [RESC1005X40N]
R46  0  Mounted: DNP  [RESC1005X40N]
R47  0  Mounted: DNP  [RESC1005X40N]
R48  0  [RESC1005X40N]
R49  0  [RESC1005X40N]
R50  0  [RESC1005X40N]
R51  0  [RESC1005X40N]
R52  0  Mounted: DNP  [RESC1005X40N]
R53  0  Mounted: DNP  [RESC1005X40N]
R54  0  Mounted: DNP  [RESC1005X40N]
R55  0  Mounted: DNP  [RESC1005X40N]
R56  0  Mounted: DNP  [RESC1005X40N]
R57  0  [RESC1005X40N]
R58  0  [RESC1005X40N]
R59  0  [RESC1005X40N]
TR1  1:2  [XFMR_MINI-CIRCUITS_DB1627]
U1  AD8363ACPZ-WP  [ADI-CP-16-10_M]

### Blocks framed on the sheet
Dicrete-elemet filter with R57/59 & R58/C28: R43-R56
3x Mini-Circuits FV1206 filters: FL2-FL4

### Ports
ATT_CTRL (harness ATT_CTRL), DAC_OUT_N (in), DAC_OUT_P (in), PD_OUT (out), RF_OUT (out), RFSW_CTRL (in), TEMP (out)

### Harnesses
ATT_CTRL: LE, S_IN, CLK, RST

### Nets
GND: C12.1 C13.1 C14.1 C15.1 C16.1 C17.1 C18.1 C19.1 C20.1 C21.1 C22.1 C23.1 C24.1 C30.1 C38.2 C39.1 C40.1 C44.1 C45.2 C48.2 C55.1 C57.2 C59.1 C60.1 C61.2 C62.2 FL2.2(GND) FL2.4(GND) FL3.2(GND) FL3.4(GND) FL4.2(GND) FL4.4(GND) IC3.1(NC) IC3.3(NC) IC3.5(NC) IC3.12(NC) IC3.14(NC) IC3.16(NC) IC3.17(NC) IC3.18(NC) IC3.23(NC) IC3.25(GND) IC4.1(GND) IC4.3(GND) IC4.4(GND) IC4.6(GND) IC4.7(EP) IC5.2(GND) IC5.4(GND) IC7.10(GND) IC7.11(GND) IC7.17(GND) R3.1 R4.1 R18.1 R19.1 R20.1 R23.1 R25.2 R27.1 R31.1 R32.1 R38.2 R43.1 R44.1 R45.1 R46.1 R47.1 R52.1 R53.1 R54.1 R55.1 R56.1 R57.2 R58.2 U1.4(COMM) U1.9(COMM) U1.17(EP)
VCCP_5V0: L6.2 L7.1 L8.2
VCCP_11V5_A: C12.2 C13.2 R5.1
DAC_OUT_N: C46.1 ; port DAC_OUT_N
DAC_OUT_P: C37.1 ; port DAC_OUT_P
PD_IN: C47.2 IC4.2(RFIN) R18.2 R19.2
PD_OUT: R26.2 R27.2 ; port PD_OUT
RF_OUT: C50.2 ; port RF_OUT
RFSW_CTRL: IC7.2(VCTL) R20.2 ; port RFSW_CTRL
TEMP: U1.8(TEMP) ; port TEMP
VREF_AD8363: R28.1 R29.2 R30.1 U1.11(VREF)
NetC14_2: C14.2 IC3.6(ACG1)
NetC15_2: C15.2 IC3.7(ACG2)
NetC16_2: C16.2 IC3.8(ACG3)
NetC17_2: C17.2 IC3.9(ACG4)
NetC18_2: C18.2 IC3.10(ACG5)
NetC19_2: C19.2 IC3.11(ACG6)
NetC20_2: C20.2 IC3.13(ACG7)
NetC21_2: C21.2 C22.2 C23.2 C24.2 IC3.2(VCC) L7.2
NetC28_1: C28.1 FL4.3(RFOUT)
NetC28_2: C28.2 IC5.1(RF_IN)
NetC29_1: C29.1 IC5.3(RF_OUT) L1.3
NetC29_2: C29.2 IC3.4(RF1)
NetC30_2: C30.2 TR1.5(NC)
NetC36_1: C36.1 IC3.15(RF2)
NetC36_2: C36.2 IC7.3(RFC)
NetC37_2: C37.2 C44.2 TR1.6(S1)
NetC38_1: C38.1 C39.2 C40.2 IC7.1(VDD) L6.1
NetC45_1: C45.1 TR1.1(P1)
NetC46_2: C46.2 C48.1 TR1.4(S1)
NetC47_1: C47.1 IC7.12(RF2)
NetC49_1: C49.1 IC7.9(RF1)
NetC49_2: C49.2 R2.1 R3.2
NetC50_1: C50.1 R2.2 R4.2
NetC55_2: C55.2 U1.15(INLO)
NetC56_1: C56.1 IC4.5(RFOUT)
NetC56_2: C56.2 U1.14(INHI)
NetC57_1: C57.1 U1.5(CLPF)
NetC58_1: C58.1 C59.2 C60.2 C61.1 C62.1 L8.1 U1.3(VPOS) U1.10(VPOS)
NetC58_2: C58.2 U1.2(CHPF)
NetFL2_1: FL2.1(RFIN) R59.2
NetFL2_3: FL2.3(RFOUT) FL3.1(RFIN)
NetFL3_3: FL3.3(RFOUT) FL4.1(RFIN)
NetIC3_20: IC3.20(~{RESET}) ; port ATT_CTRL.RST
NetIC3_21: IC3.21(SHIFT_CLOCK) ; port ATT_CTRL.CLK
NetIC3_22: IC3.22(LATCH_ENABLE) ; port ATT_CTRL.LE
NetIC3_24: IC3.24(SERIAL_INPUT) ; port ATT_CTRL.S_IN
NetIC7_5: IC7.5(EN) R23.2
NetL1_1: L1.1 R5.2
NetR25_1: R25.1 R28.2 U1.12(VTGT)
NetR26_1: R26.1 U1.6(VOUT) U1.7(VSET)
NetR29_1: R29.1 R31.2 U1.16(TCM1)
NetR30_2: R30.2 R32.2 U1.1(TCM2/PWDN)
NetR38_1: R38.1 TR1.2(P1)
NetR43_2: R43.2 R48.1 R52.2 R57.1
NetR44_2: R44.2 R48.2 R49.1 R53.2
NetR45_2: R45.2 R49.2 R50.1 R54.2
NetR46_2: R46.2 R50.2 R51.2 R55.2
NetR47_2: R47.2 R51.1 R56.2 R58.1
NetR59_1: R59.1 TR1.3(P1)

Not connected (* = marked no-connect by the designer): IC3 19(SERIAL_OUTPUT); IC7 4(NC) 6(NC) 7(NC) 8(NC) 13(NC) 14(NC) 15(NC) 16(NC); U1 13(NC)

### Channels
U_DAC_channel1: designators end in A; ports DAC_OUT_N=DAC1_OUT_N DAC_OUT_P=DAC1_OUT_P PD_OUT=ADC_CH3 RF_OUT=RF1_OUT RFSW_CTRL=MEZZ_IO7 TEMP=ADC_CH0
U_DAC_channel2: designators end in B; ports DAC_OUT_N=DAC2_OUT_N DAC_OUT_P=DAC2_OUT_P PD_OUT=ADC_CH2 RF_OUT=RF2_OUT RFSW_CTRL=MEZZ_IO2 TEMP=ADC_CH1

### Layout directives
net class 50_Ohms: NetC28A_1, NetC28A_2, NetC29A_2, NetC36A_1, NetC36A_2, NetC47A_1, NetC49A_1, NetC49A_2, NetC50A_1, NetC55A_2, NetC56A_1, NetC56A_2, NetFL2A_1, NetFL2A_3, NetFL3A_3, NetR43A_2, NetR44A_2, NetR45A_2, NetR46A_2, NetR47A_2, NetR59A_1, PD_IN_U_DAC_channel1, RF1_OUT

### Notes on the sheet
- One of Two RF filters can be used switchable by the two jumpers (R57/59 and R58/C28)
  for jumper configuration see ADC_channel sheet
  Populate Filter Components according to individual project design
  For Custom FIlter reference design and Possible configurations (as AWR MWO projects) are found in documentation folder
- (near C29) Amplifier
- (near C29) +13dB @ 2GHz typ.
- Jumper
- (near IC3) Digital Attenuator
- SPDT switch
- (near C55) Jumper
- (near U1) Power Detector
- (near IC4) -12dB
- Project/Equipment
- Document
- Designer
- Drawn by
- Check.by
- File
- Last Mod.
- Print Date
- Sheet
- Size
- A3
- of
- Rev
- (in symbol FIL_MINI-CIRCUITS_LFCN-3000+) IN; OUT
- (in symbol HMC349ALP4CE) 50
- (in symbol HMC542BLP4E) 0.5dB; LE; 1dB; S_IN; S_OUT; 2dB; CONTROL INTERFACE; 4dB; CLK; 8dB; RST; 16dB
- (in symbol R0201_100R_1%_0.05W_200PPM) 1%
- (in symbol R0402_1K_1%_0.0625W_100PPM) 1%
- (in symbol R0402_4K7_1%_0.0625W_100PPM) 1%
- (in symbol R0402_10K_1%_0.0625W_100PPM) 1%
- (in symbol R0402_13K_1%_0.0625W_100PPM) 1%
- (in symbol R0603_1K4_0.1%_0.063W_10PPM) 0.1%
- (in symbol R0603_3K24_0.1%_0.063W_10PPM) 0.1%
- (in symbol R0603_845R_0.1%_0.063W_10PPM) 0.1%
- (in symbol R1206_100R_1%_0.25W_100PPM) 1%
- (in symbol XFMR_MINI-CIRCUITS_TCM2-43X+) SEC; PRI

### Library data of the parts
C12 = CC0805_1UF_35V_20%_X7R: Non-polarised capacitor; Part Description: SMD Multilayer Chip Ceramic Capacitor; Manufacturer: GENERIC; Manufacturer1 Part Number: GMK212B7105MG-T; Voltage: 35V; TC: X7R; Tolerance: ±20%; Part Number: CC0805_1UF_35V_20%_X7R; Component Kind: Standard; Component Type: Standard; Pin Count: 2; Value: 1uF; Status: Not Recommended; Manufacturer Part Number: CC0805_1UF_35V_20%_X7R; Case: 0805; Mounted: Yes; Socket: No; SMD: Yes; Sense: No; Manufacturer1 Example: TAIYO YUDEN; Manufacturer1 ComponentHeight: 1.35mm; HelpURL: \\cern.ch\dfs\Applications\Altium\Datasheets\CC0805_X7R_TAIYO-YUDEN_HIGH-VALUE.pdf; Author: CERN DEM JLC; CreateDate: 2011-06-22; LatestRevisionDate: 2011-06-22
C13 = CC0603_100NF_50V_10%_X7R: Non-polarised capacitor; Part Description: SMD Multilayer Chip Ceramic Capacitor; Manufacturer: GENERIC; Manufacturer1 Part Number: 223858615649; Voltage: 50V; TC: X7R; Tolerance: ±10%; Part Number: CC0603_100NF_50V_10%_X7R; Component Kind: Standard; Component Type: Standard; Pin Count: 2; Value: 100nF; Status: Preferred; Manufacturer Part Number: CC0603_100NF_50V_10%_X7R; Case: 0603; Mounted: Yes; Socket: No; SMD: Yes; Sense: No; Manufacturer1 Example: PHYCOMP; Manufacturer1 ComponentHeight: 0.87mm; HelpURL: \\cern.ch\dfs\Applications\Altium\Datasheets\CC0603_X7R_PHYCOMP.pdf; Author: CERN DEM JLC; CreateDate: 2007-12-03; LatestRevisionDate: 2007-12-03
C14-C20 C28 C29 C36 C37 C46 C47 C49 C50 C55 C56 = CC0402_10NF_16V_10%_X7R: Non-polarised capacitor; Part Description: SMD Multilayer Chip Ceramic Capacitor; Manufacturer: GENERIC; Manufacturer1 Part Number: 223878715636; Voltage: 16V; TC: X7R; Tolerance: ±10%; Part Number: CC0402_10NF_16V_10%_X7R; Component Kind: Standard; Component Type: Standard; Pin Count: 2; Value: 10nF; Status: Not Recommended; Manufacturer Part Number: CC0402_10NF_16V_10%_X7R; Case: 0402; Mounted: Yes; Socket: No; SMD: Yes; Sense: No; Manufacturer1 Example: PHYCOMP; Manufacturer1 ComponentHeight: 0.55mm; HelpURL: \\cern.ch\dfs\Applications\Altium\Datasheets\CC0402_X7R_PHYCOMP.pdf; Author: CERN DEM JLC; CreateDate: 2007-12-03; LatestRevisionDate: 2007-12-03
C21 C39 = CC0603_10UF_16V_20%_X5R: Non-polarised capacitor; Part Description: SMD Multilayer Chip Ceramic Capacitor; Manufacturer: GENERIC; Manufacturer1 Part Number: GRM188R61C106MA73D; Voltage: 16V; TC: X5R; Tolerance: ±20%; Part Number: CC0603_10UF_16V_20%_X5R; Component Kind: Standard; Component Type: Standard; Pin Count: 2; Value: 10uF; Status: None; Manufacturer Part Number: CC0603_10UF_16V_20%_X5R; Case: 0603; Mounted: Yes; Socket: No; SMD: Yes; Sense: No; Manufacturer1 Example: MURATA; Manufacturer1 ComponentHeight: 0.8mm; HelpURL: \\cern.ch\dfs\Applications\Altium\Datasheets\CC0603_X5R_MURATA_GRM.pdf; Author: CERN DEM MR; CreateDate: 2016-03-02; LatestRevisionDate: 2016-03-02
C22 C40 = CC0402_100NF_16V_10%_X7R: as C35 on sheet ADC_channel; Part Number: CC0402_100NF_16V_10%_X7R; Component Kind: Standard; Component Type: Standard; Pin Count: 2; Value: 100nF; Status: Not Recommended; Manufacturer Part Number: CC0402_100NF_16V_10%_X7R; Case: 0402; Mounted: Yes; Socket: No; SMD: Yes; Sense: No; Manufacturer1 Example: MURATA; Manufacturer1 ComponentHeight: 0.55mm; HelpURL: \\cern.ch\dfs\Applications\Altium\Datasheets\CC0402_X7R_MURATA_GRM.pdf; Author: CERN DEM JLC; CreateDate: 2013-12-05; LatestRevisionDate: 2007-12-03
C23 = CC0402_1NF_50V_10%_X7R: as C3 on sheet ADC_channel; Part Number: CC0402_1NF_50V_10%_X7R; Component Kind: Standard; Component Type: Standard; Pin Count: 2; Value: 1nF; Status: Not Recommended; Manufacturer Part Number: CC0402_1NF_50V_10%_X7R; Case: 0402; Mounted: Yes; Socket: No; SMD: Yes; Sense: No; Manufacturer1 Example: PHYCOMP; Manufacturer1 ComponentHeight: 0.55mm; HelpURL: \\cern.ch\dfs\Applications\Altium\Datasheets\CC0402_X7R_PHYCOMP.pdf; Author: CERN DEM JLC; CreateDate: 2007-12-03; LatestRevisionDate: 2007-12-03
C24 C30 C38 C45 C61 C62 = CC0402_100PF_50V_5%_C0G: Non-polarised capacitor; Part Description: SMD Multilayer Chip Ceramic Capacitor; Manufacturer: GENERIC; Manufacturer1 Part Number: C0402C101J5GACTU; Voltage: 50V; TC: C0G/NP0; Tolerance: ±5%; Part Number: CC0402_100PF_50V_5%_C0G; Component Kind: Standard; Component Type: Standard; Pin Count: 2; Value: 100pF; Status: Preferred; Manufacturer Part Number: CC0402_100PF_50V_5%_C0G; Case: 0402; Socket: No; SMD: Yes; Sense: No; Manufacturer1 Example: KEMET; Manufacturer1 ComponentHeight: 0.55mm; HelpURL: \\cern.ch\dfs\Applications\Altium\Datasheets\CC0805_C0G_KEMET_(Commercial Grade).pdf; Author: CERN DEM JLC; CreateDate: 2007-12-03; LatestRevisionDate: 2015-04-22
  C24 C38 C61 C62: Mounted: Yes
C44 C48 = CMP-1034-00013-1: CAP 0.5pF 10V ±0.1pF 0402 (1005 Metric) Thickness 0.6mm SMD; Case-Metric: 1005; Tolerance: Â±0.1pF; Case-EIA: 0402; Value: 0.5pF; Max Thickness: 0.6 mm; Rated Voltage: 10 V; Technology: SMT
C57-C60 = CC0402_100NF_16V_10%_X5R: as C1 on sheet ADC_channel; Part Number: CC0402_100NF_16V_10%_X5R; Component Kind: Standard; Component Type: Standard; Pin Count: 2; Value: 100nF; Status: None; Manufacturer Part Number: CC0402_100NF_16V_10%_X5R; Case: 0402; Socket: No; SMD: Yes; Sense: No; Manufacturer1 Example: MURATA; Manufacturer1 ComponentHeight: 0.55mm; HelpURL: \\cern.ch\dfs\Applications\Altium\Datasheets\CC0402_X5R_MURATA_GRM.pdf; Author: CERN DEM JLC; CreateDate: 2013-12-10; LatestRevisionDate: 2013-12-10
  C57 C59 C60: Mounted: Yes
FL2-FL4 = FIL_MINI-CIRCUITS_LFCN-3000+: 50 Ohm DC to 3000MHz Low Pass Filter; Part Description: 50 Ohm Low Pass Filter; Part Number: FIL_MINI-CIRCUITS_LFCN-3000+; Component Kind: Standard; Component Type: Standard; Pin Count: 2; Value: DC to 3000MHz; Status: None; Manufacturer: MINI-CIRCUITS; Manufacturer Part Number: LFCN-3000+; Mounted: Yes; Socket: No; SMD: Yes; Sense: No; ComponentHeight: 0.94mm; HelpURL: \\cern.ch\dfs\Applications\Altium\Datasheets\FIL_MINI-CIRCUITS_LFCN-3000+.pdf; Author: CERN DEM JLC; CreateDate: 2013-12-09; LatestRevisionDate: 2013-12-09
IC3 = HMC542BLP4E: 0.5dB LSB GaAs MMIC 6-bit Digital Serial Control Attenuator, DC - 4GHz; Part Description: 0.5dB LSB GaAs MMIC 6-bit Digital Serial Control Attenuator, DC to 4GHz; Manufacturer: HITTITE MICROWAVE CORP; PressFit: No; Bonding: No; Part Number: HMC542BLP4E; Component Kind: Standard; Component Type: Standard; Device: HMC542BLP4E; PackageDescription: QFN, 0.50mm Pitch, Square; 24 Pin, 4.00mm L X 4.00mm W X 1.00mm H Body (w/thermal Tab 2.95 X 2.95mm), IPC Medium Density; Manufacturer Part Number: HMC542BLP4E; Pin Count: 25; Case: QFN24; Mounted: Yes; Socket: No; SMD: Yes; Sense: No; ComponentHeight: 1mm; Author: CERN DEM JMW; HelpURL: \\cern.ch\dfs\Applications\Altium\Datasheets\HMC542BLP4E.pdf; CreateDate: 2016-08-17; LatestRevisionDate: 2016-08-17
IC4 = YAT-12+: DC to 18GHz, 2W, 50 Ohm, 4dB Attenuator; Part Description: DC to 18GHz, 2W, 50 Ohms, 12dB Attenuator; Manufacturer: MINI-CIRCUITS; PressFit: No; Bonding: No; Part Number: YAT-12+; Component Kind: Standard; Component Type: Standard; Device: YAT-12+; PackageDescription: MINI-CIRCUITS MC1630 Case, 0.65mm pitch, 6 pin, 2mm X 2mm X 0.85mm H body (w/thermal tab 0.65 X 1.25mm); Manufacturer Part Number: YAT-12+; Pin Count: 7; Mounted: Yes; Socket: No; SMD: Yes; Sense: No; ComponentHeight: 0.85mm; Author: CERN DEM JLC; HelpURL: \\cern.ch\dfs\Applications\Altium\Datasheets\YAT-12+.pdf; CreateDate: 2015-04-20; LatestRevisionDate: 2015-04-20
IC5 = ERA-4XSM+: DC-4GHz Monolithic Amplifier; Manufacturer: MINI-CIRCUITS; PressFit: No; Bonding: No; Part Number: ERA-4XSM+; Component Kind: Standard; Component Type: Standard; Device: ERA-4XSM+; PackageDescription: MINI-CIRCUITS WW107 Case, Body 2.16mm Diameter X 1.52mm H; Part Description: DC-4GHz Monolithic Amplifier; Manufacturer Part Number: ERA-4XSM+; Pin Count: 4; Mounted: Yes; Socket: No; SMD: Yes; Sense: No; ComponentHeight: 1.52mm; Author: CERN DEM JMW; HelpURL: \\cern.ch\dfs\Applications\Altium\Datasheets\ERA-4XSM+.pdf; CreateDate: 11.08.2016; LatestRevisionDate: 11.08.2016
IC7 = HMC349ALP4CE: DC-4GHz High Isolation SPDT Non-Reflective Switch; Manufacturer: ANALOG DEVICES; PressFit: No; Bonding: No; Part Number: HMC349ALP4CE; Component Kind: Standard; Component Type: Standard; Device: HMC349ALP4CE; PackageDescription: QFN, 0.65mm pitch,square; 4 pin X 4 pin, 4mm X 4mm X 1mm H body (w/thermal tab 2.55 X 2.55mm),  IPC Medium Density; Part Description: DC-4GHz High Isolation SPDT Non-Reflective Switch; Manufacturer Part Number: HMC349ALP4CE; Pin Count: 17; Case: QFN16; Mounted: Yes; Socket: No; SMD: Yes; Sense: No; ComponentHeight: 1mm; Author: CERN DEM JLC; HelpURL: \\cern.ch\dfs\Applications\Altium\Datasheets\HMC349ALP4CE.pdf; CreateDate: 2017-02-23; LatestRevisionDate: 2017-02-23
L1 = IND_MINI-CIRCUITS_TCCH-80+: 50 Ohms, 50 to 8200 MHz RF Choke; Power: 200mA; Resistance: 0.1R; Part Number: IND_MINI-CIRCUITS_TCCH-80+; Component Kind: Standard; Component Type: Standard; Pin Count: 4; Value: 0.5uH@200mA; Status: None; Part Description: 50 Ohms, 50 to 8200 MHz RF Choke; Manufacturer: MINI-CIRCUITS; Mounted: Yes; Socket: No; SMD: Yes; Sense: No; ComponentHeight: 3.81mm; HelpURL: \\cern.ch\dfs\Applications\Altium\Datasheets\IND_MINI-CIRCUITS_TCCH-80+.pdf; Author: CERN DEM JLC; CreateDate: 2011-12-19; LatestRevisionDate: 2011-12-19
L6-L8 = IND0603_TDK_MPZ1608R391A: as L2 on sheet ADC_channel; Part Number: IND0603_TDK_MPZ1608R391A; Component Kind: Standard; Component Type: Standard; Pin Count: 2; Value: 390R@100MHz; Status: None; Manufacturer Part Number: MPZ1608R391A; Case: 0603; Mounted: Yes; Socket: No; SMD: Yes; Sense: No; ComponentHeight: 0.95mm; HelpURL: \\cern.ch\dfs\Applications\Altium\Datasheets\IND0603_TDK_MPZ1608.pdf; Author: CERN DEM JLC; CreateDate: 2009-12-02; LatestRevisionDate: 2009-12-02
R2-R4 R38 R43-R59 = R0402_0R_JUMPER: as R6 on sheet ADC_channel; Part Number: R0402_0R_JUMPER; Component Kind: Standard; Component Type: Standard; Pin Count: 2; Value: 0; Status: Not recommended; Manufacturer Part Number: R0402_0R_JUMPER; Case: 0402; Sense: No; Socket: No; SMD: Yes; Manufacturer1 Example: YAGEO PHYCOMP; Manufacturer1 ComponentHeight: 0.4mm; HelpURL: \\cern.ch\dfs\Applications\Altium\Datasheets\R0402_Phycomp_RC0402.pdf; Author: CERN DEM JLC; CreateDate: 2007-12-03; LatestRevisionDate: 2012-10-17
  R2 R38 R48-R51 R57-R59: Mounted: Yes
R5 = R1206_100R_1%_0.25W_100PPM: Resistor - 1%; Part Description: General Purpose Thick Film Chip Resistor; Manufacturer: GENERIC; Manufacturer1 Part Number: NRC12F4700TRF; Power: 0.25W; TC: ±100ppm/°C; Part Number: R1206_100R_1%_0.25W_100PPM; Component Kind: Standard; Component Type: Standard; Pin Count: 2; Value: 100; Status: Preferred; Tolerance: ±1%; Manufacturer Part Number: R1206_100R_1%_0.25W_100PPM; Case: 1206; Mounted: Yes; Sense: No; Socket: No; SMD: Yes; Manufacturer1 Example: NIC COMPONENT; Manufacturer1 ComponentHeight: 0.65mm; HelpURL: \\cern.ch\dfs\Applications\Altium\Datasheets\R1206_NIC_NRC.pdf; Author: CERN DEM JLC; CreateDate: 2007-12-03; LatestRevisionDate: 2008-03-13
R18 R19 = R0201_100R_1%_0.05W_200PPM: Resistor - 1%; Part Description: Thick Film Chip Resistor; Manufacturer: GENERIC; Manufacturer1 Part Number: CRCW0201100RFNED; Power: 0.05W; TC: ±200ppm/°C; Part Number: R0201_100R_1%_0.05W_200PPM; Component Kind: Standard; Component Type: Standard; Pin Count: 2; Value: 100; Status: Not recommended; Tolerance: ±1%; Manufacturer Part Number: R0201_100R_1%_0.05W_200PPM; Case: 0201; Mounted: Yes; Sense: No; Socket: No; SMD: Yes; Manufacturer1 Example: VISHAY; Manufacturer1 ComponentHeight: 0.27mm; HelpURL: \\cern.ch\dfs\Applications\Altium\Datasheets\R0201_VISHAY_CRCW e3.pdf; Author: CERN DEM JLC; CreateDate: 2014-11-13; LatestRevisionDate: 2014-11-13
R20 R23 = R0402_4K7_1%_0.0625W_100PPM: Resistor - 1%; Part Description: General Purpose Thick Film Chip Resistor; Manufacturer: GENERIC; Manufacturer1 Part Number: 232270674702L; TC: ±100ppm/°C; Part Number: R0402_4K7_1%_0.0625W_100PPM; Component Kind: Standard; Component Type: Standard; Pin Count: 2; Value: 4k7; Status: Not recommended; Power: 0.0625W; Tolerance: ±1%; Manufacturer Part Number: R0402_4K7_1%_0.0625W_100PPM; Case: 0402; Mounted: Yes; Sense: No; Socket: No; SMD: Yes; Manufacturer1 Example: YAGEO PHYCOMP; Manufacturer1 ComponentHeight: 0.4mm; HelpURL: \\cern.ch\dfs\Applications\Altium\Datasheets\R0402_Phycomp_RC0402.pdf; Author: CERN DEM JLC; CreateDate: 2007-12-03; LatestRevisionDate: 2012-10-17
R25 = R0603_1K4_0.1%_0.063W_10PPM: Resistor - 0.1%; Part Description: Thin Film Chip Resistor; Manufacturer: GENERIC; Manufacturer1 Part Number: RN73C1J1K4BTDF; Power: 0.063W; TC: ±10ppm; Part Number: R0603_1K4_0.1%_0.063W_10PPM; Component Kind: Standard; Component Type: Standard; Pin Count: 2; Value: 1k4; Status: Not recommended; Tolerance: ±0.1%; Manufacturer Part Number: R0603_1K4_0.1%_0.063W_10PPM; Case: 0603; Mounted: Yes; Sense: No; Socket: No; SMD: Yes; Manufacturer1 Example: TYCO HOLSWORTHY; Manufacturer1 ComponentHeight: 0.5mm; HelpURL: \\cern.ch\dfs\Applications\Altium\Datasheets\R0603_Tyco_RN73.pdf; Author: CERN DEM JLC; CreateDate: 2007-12-03; LatestRevisionDate: 2008-03-13
R26 R27 R31 = R0402_1K_1%_0.0625W_100PPM: as R41 on sheet ADC_channel; Part Number: R0402_1K_1%_0.0625W_100PPM; Component Kind: Standard; Component Type: Standard; Pin Count: 2; Value: 1k; Status: Not recommended; Power: 0.0625W; Tolerance: ±1%; Manufacturer Part Number: R0402_1K_1%_0.0625W_100PPM; Case: 0402; Mounted: Yes; Sense: No; Socket: No; SMD: Yes; Manufacturer1 Example: YAGEO PHYCOMP; Manufacturer1 ComponentHeight: 0.4mm; HelpURL: \\cern.ch\dfs\Applications\Altium\Datasheets\R0402_Phycomp_RC0402.pdf; Author: CERN DEM JLC; CreateDate: 2007-12-03; LatestRevisionDate: 2012-10-17
R28 = R0603_845R_0.1%_0.063W_10PPM: Resistor - 0.1%; Part Description: Thin Film Chip Resistor; Manufacturer: GENERIC; Manufacturer1 Part Number: RN73C1J845RBTDF; Power: 0.063W; TC: ±10ppm; Part Number: R0603_845R_0.1%_0.063W_10PPM; Component Kind: Standard; Component Type: Standard; Pin Count: 2; Value: 845; Status: Not recommended; Tolerance: ±0.1%; Manufacturer Part Number: R0603_845R_0.1%_0.063W_10PPM; Case: 0603; Mounted: Yes; Sense: No; Socket: No; SMD: Yes; Manufacturer1 Example: TYCO HOLSWORTHY; Manufacturer1 ComponentHeight: 0.5mm; HelpURL: \\cern.ch\dfs\Applications\Altium\Datasheets\R0603_Tyco_RN73.pdf; Author: CERN DEM JLC; CreateDate: 2007-12-03; LatestRevisionDate: 2008-03-13
R29 = R0603_3K24_0.1%_0.063W_10PPM: Resistor - 0.1%; Part Description: Thin Film Chip Resistor; Manufacturer: GENERIC; Manufacturer1 Part Number: RN73C1J3K24BTDF; Power: 0.063W; TC: ±10ppm; Part Number: R0603_3K24_0.1%_0.063W_10PPM; Component Kind: Standard; Component Type: Standard; Pin Count: 2; Value: 3k24; Status: Not recommended; Tolerance: ±0.1%; Manufacturer Part Number: R0603_3K24_0.1%_0.063W_10PPM; Case: 0603; Mounted: Yes; Sense: No; Socket: No; SMD: Yes; Manufacturer1 Example: TYCO HOLSWORTHY; Manufacturer1 ComponentHeight: 0.5mm; HelpURL: \\cern.ch\dfs\Applications\Altium\Datasheets\R0603_Tyco_RN73.pdf; Author: CERN DEM JLC; CreateDate: 2007-12-03; LatestRevisionDate: 2008-03-13
R30 = R0402_13K_1%_0.0625W_100PPM: Resistor - 1%; Part Description: General Purpose Thick Film Chip Resistor; Manufacturer: GENERIC; Manufacturer1 Part Number: 232270671303L; TC: ±100ppm/°C; Part Number: R0402_13K_1%_0.0625W_100PPM; Component Kind: Standard; Component Type: Standard; Pin Count: 2; Value: 13k; Status: Not recommended; Power: 0.0625W; Tolerance: ±1%; Manufacturer Part Number: R0402_13K_1%_0.0625W_100PPM; Case: 0402; Mounted: Yes; Sense: No; Socket: No; SMD: Yes; Manufacturer1 Example: YAGEO PHYCOMP; Manufacturer1 ComponentHeight: 0.4mm; HelpURL: \\cern.ch\dfs\Applications\Altium\Datasheets\R0402_Phycomp_RC0402.pdf; Author: CERN DEM JLC; CreateDate: 2007-12-03; LatestRevisionDate: 2012-10-17
R32 = R0402_10K_1%_0.0625W_100PPM: Resistor - 1%; Part Description: General Purpose Thick Film Chip Resistor; Manufacturer: GENERIC; Manufacturer1 Part Number: 232270671003L; TC: ±100ppm/°C; Part Number: R0402_10K_1%_0.0625W_100PPM; Component Kind: Standard; Component Type: Standard; Pin Count: 2; Value: 10k; Status: Not recommended; Power: 0.0625W; Tolerance: ±1%; Manufacturer Part Number: R0402_10K_1%_0.0625W_100PPM; Case: 0402; Mounted: Yes; Sense: No; Socket: No; SMD: Yes; Manufacturer1 Example: YAGEO PHYCOMP; Manufacturer1 ComponentHeight: 0.4mm; HelpURL: \\cern.ch\dfs\Applications\Altium\Datasheets\R0402_Phycomp_RC0402.pdf; Author: CERN DEM JLC; CreateDate: 2007-12-03; LatestRevisionDate: 2012-10-17
TR1 = XFMR_MINI-CIRCUITS_TCM2-43X+: 50 OHMS 10 to 4000 MHz RF Transformer; Power: 0.4W; Part Number: XFMR_MINI-CIRCUITS_TCM2-43X+; Component Kind: Standard; Component Type: Standard; Pin Count: 6; Value: 1:2; Status: None; Part Description: 50 Ohms 10 to 4000MHz RF Transformer; Manufacturer: MINI-CIRCUITS; Manufacturer Part Number: TCM2-43X+; Mounted: Yes; Socket: No; Sense: No; SMD: Yes; ComponentHeight: 4.06mm; HelpURL: \\cern.ch\dfs\Applications\Altium\Datasheets\XFMR_MINI-CIRCUITS_TCM2-43X+.pdf; Author: CERN DEM BC; CreateDate: 2016-02-12; LatestRevisionDate: 2016-02-12
U1 = CMP-0284-00043-1: 50 Hz to 6 GHz,50 dB TruPwr™ Detector, 3µs Response Time, CP-16-10, Pb-Free, 64 Tray; Supply Current: 60mA; Response Time (ns typ): 3Âµs; Output Response: Linear in dB; RF Frequency (MHz): 6GHz; Temp Stability (dB): 500mdB; Voltage Supply (V): 4.5 to 5.5; Dynamic Range (dB): 50dB; Product Description: 125Â°C Operation, Broadband; ComponentLink3Description: Package Specification; Code_JEDEC: MO-220-VGGC; ComponentLink1Description: Manufacturer URL; ComponentLink2Description: Datasheet; PackageVersion: 010606-0; PackageReference: CP-16-10; ComponentLink1URL: www.analog.com; PackageDescription: 16-Lead Lead Frame Chip Scale Package [LFCSP_VQ]; ComponentLink2URL: http://www.analog.com/static/imported-files/data_sheets/AD8363.pdf; ComponentLink3URL: http://www.analog.com/static/imported-files/packages/PKG_PDF/LFCSP(CP)/CP_16_10.pdf; DatasheetVersion: Rev. A